# Altium schematic sheet Balanced Line Connectors.SchDoc
size Letter; SheetNumber: 2; SheetTotal: 11
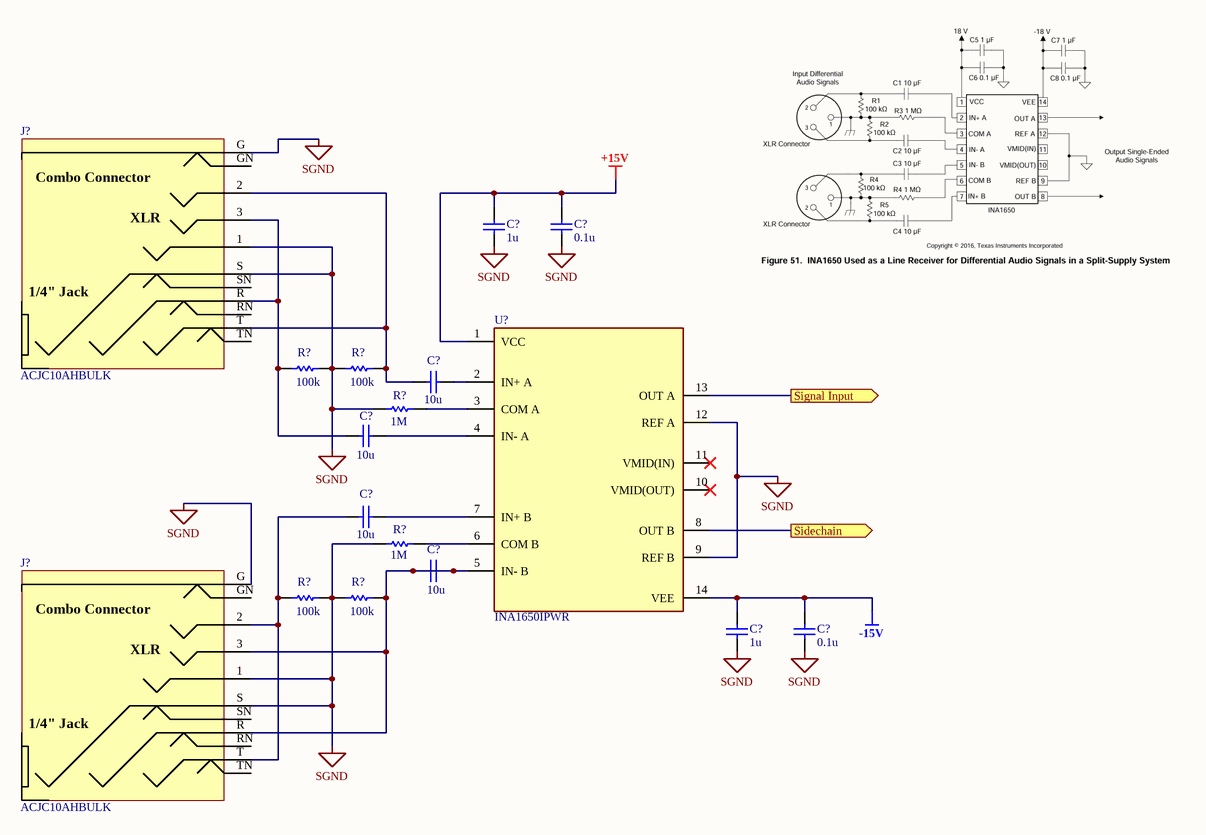
[diagram p0: Balanced Line Connectors.SchDoc]

## Parts
(Parts that share a designator on the sheet are numbered #1, #2 ... from top to bottom, then left to right.)
C?#1  value 1u  (hidden comment: Capacitor)
C?#2  value 0.1u  (hidden comment: Capacitor)
C?#3  value 10u  (hidden comment: Capacitor)
C?#4  value 10u  (hidden comment: Capacitor)
C?#5  value 10u  (hidden comment: Capacitor)
C?#6  value 10u  (hidden comment: Capacitor)
C?#7  value 1u  (hidden comment: Capacitor)
C?#8  value 0.1u  (hidden comment: Capacitor)
J?#1  ACJC10AHBULK
J?#2  ACJC10AHBULK
R?#1  value 100k  (hidden comment: Resistor)
R?#2  value 100k  (hidden comment: Resistor)
R?#3  value 1M  (hidden comment: Resistor)
R?#4  value 1M  (hidden comment: Resistor)
R?#5  value 100k  (hidden comment: Resistor)
R?#6  value 100k  (hidden comment: Resistor)
U?  INA1650IPWR  [FP-PW0014A-IPC_C]

## Ports
Sidechain (out), Signal Input (out)

## Nets
+15V: C?#1.2 C?#2.2 U?.1(VCC)
-15V: C?#7.2 C?#8.2 U?.14(VEE)
SGND: C?#1.1 C?#2.1 C?#7.1 C?#8.1 J?#1.1 J?#1.G J?#1.S J?#2.1 J?#2.G J?#2.S R?#1.1 R?#2.2 R?#3.2 R?#4.2 R?#5.1 R?#6.2 U?.9(REF_B) U?.12(REF_A)
Sidechain: U?.8(OUT_B) ; port Sidechain
Signal Input: U?.13(OUT_A) ; port Signal Input
NetC?#3_1: C?#3.1 U?.2(IN+_A)
NetC?#3_2: C?#3.2 J?#1.2 J?#1.T R?#2.1
NetC?#4_1: C?#4.1 U?.4(IN-_A)
NetC?#4_2: C?#4.2 J?#1.3 J?#1.R R?#1.2
NetC?#5_1: C?#5.1 U?.7(IN+_B)
NetC?#5_2: C?#5.2 J?#2.2 J?#2.T R?#5.2
NetC?#6_1: C?#6.1 C?#6.2 J?#2.3 J?#2.R R?#6.1 U?.5(IN-_B)
NetR?#3_1: R?#3.1 U?.3(COM_A)
NetR?#4_1: R?#4.1 U?.6(COM_B)

Not connected (* = marked no-connect by the designer): J?#1 GN RN SN TN; J?#2 GN RN SN TN; U? 10(VMID(OUT))* 11(VMID(IN))*

## Notes on the sheet
- (in symbol ACJC10AHBULK) Combo Connector; XLR; 1/4" Jack

## Library data of the parts
C?#1-C?#8 = Capacitor: SimulationGenericComponent: True
J?#1 J?#2 = ACJC10AHBULK: Audio/RCA Connector, 10 Pole(s), Female, Solder Terminal, Latch, Receptacle; Manufacturer: Amphenol; Supplier: Digikey; Supplier Part Number: 889-ACJC10AHBULK-ND; Manufacturer Part Number: ACJC10AHBULK; RoHS: Yes; Stock: 1003; Pricing: 1=3.96, 10=3.6, 25=3.4092, 50=3.33, 100=3.1714, 250=2.77496, 500=2.69568, 1000=2.29926, 2500=2.1407 (USD); Contact Finish - Mating: NOT SPECIFIED; Connector Type: AUDIO/RCA CONNECTOR; RoHS Compliant: Yes; ComponentLink1URL: https://datasheet.ciiva.com:443/pdfs/VipMasterIC/IC/AMPH/AMPHS14349/AMPHS14349-1.pdf?src-supplier=IHS+Markit; ComponentLink1Description: https://datasheet.ciiva.com:443/pdfs/VipMasterIC/IC/AMPH/AMPHS14349/AMPHS14349-1.pdf?src-supplier=IHS+Markit; ComponentLink2URL: https://datasheet.ciiva.com/15309/88010807000-acjc10ah-241575-15309467.pdf?src-supplier=Mouser; ComponentLink2Description: https://datasheet.ciiva.com/15309/88010807000-acjc10ah-241575-15309467.pdf?src-supplier=Mouser
R?#1-R?#6 = Resistor: TC1: 0; SimulationGenericComponent: True; TC2: 0
U? = INA1650IPWR: IC AUDIO RECEIVER 14TSSOP; Number of Channels: 2; RoHS Compliant: Yes; Packaging: Tape and Reel; Number of Pins: 14; Min Operating Temperature: -40°C; Case/Package: TSSOP; Logic Function: Receiver; Max Operating Temperature: 125°C